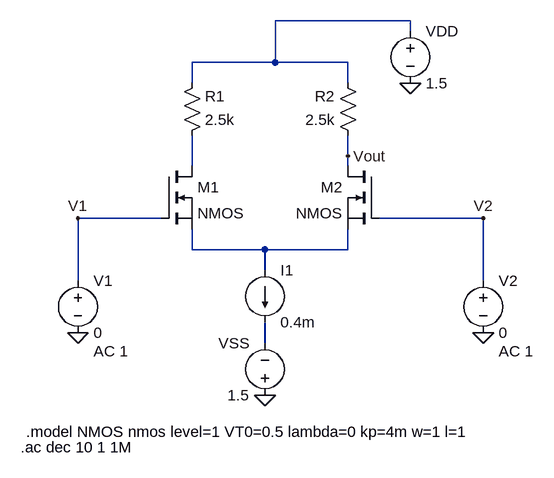
[diagram p0: schematic pag18es8.asc]
pag18es8.asc, the LTspice schematic file:
Version 4
SHEET 1 880 680
WIRE 448 -80 240 -80
WIRE 448 -64 448 -80
WIRE 240 -16 240 -80
WIRE 240 -16 112 -16
WIRE 352 -16 240 -16
WIRE 112 16 112 -16
WIRE 352 16 352 -16
WIRE 352 128 352 96
WIRE 112 144 112 96
WIRE 352 144 352 128
WIRE 64 224 -64 224
WIRE 560 224 400 224
WIRE 112 272 112 240
WIRE 224 272 112 272
WIRE 352 272 352 240
WIRE 352 272 224 272
WIRE 224 304 224 272
WIRE -64 320 -64 224
WIRE 560 320 560 224
WIRE 224 416 224 384
FLAG 448 16 0
FLAG 224 496 0
FLAG -64 400 0
FLAG 560 400 0
FLAG -64 224 V1
FLAG 560 224 V2
FLAG 352 128 Vout
SYMBOL nmos 64 144 R0
SYMATTR InstName M1
SYMBOL nmos 400 144 M0
SYMATTR InstName M2
SYMBOL res 96 112 M180
WINDOW 0 36 76 Left 2
WINDOW 3 36 40 Left 2
SYMATTR InstName R1
SYMATTR Value 2.5k
SYMBOL res 368 112 R180
WINDOW 0 36 76 Left 2
WINDOW 3 36 40 Left 2
SYMATTR InstName R2
SYMATTR Value 2.5k
SYMBOL voltage 448 -80 R0
SYMATTR InstName VDD
SYMATTR Value 1.5
SYMBOL current 224 304 R0
SYMATTR InstName I1
SYMATTR Value 0.4m
SYMBOL voltage 224 512 R180
WINDOW 0 24 96 Left 2
WINDOW 3 24 16 Left 2
SYMATTR InstName VSS
SYMATTR Value 1.5
SYMBOL voltage -64 304 R0
WINDOW 123 24 124 Left 2
WINDOW 39 0 0 Left 0
SYMATTR InstName V1
SYMATTR Value 0
SYMATTR Value2 AC 1
SYMBOL voltage 560 304 R0
WINDOW 123 24 124 Left 2
WINDOW 39 0 0 Left 0
SYMATTR InstName V2
SYMATTR Value 0
SYMATTR Value2 AC 1
TEXT -144 552 Left 2 !.model NMOS nmos level=1 VT0=0.5 lambda=0 kp=4m w=1 l=1
TEXT -152 576 Left 2 !.ac dec 10 1 1M

The netlist it stands for:
* pag18es8.asc
M1 N002 V1 N003 N003 NMOS
M2 Vout V2 N003 N003 NMOS
R1 N002 N001 2.5k
R2 Vout N001 2.5k
VDD N001 0 1.5
I1 N003 N004 0.4m
VSS 0 N004 1.5
V1 V1 0 0 AC 1
V2 V2 0 0 AC 1
.model NMOS NMOS
.model PMOS PMOS
.lib standard.mos
.model NMOS nmos level=1 VT0=0.5 lambda=0 kp=4m w=1 l=1
.ac dec 10 1 1M
.backanno
.end